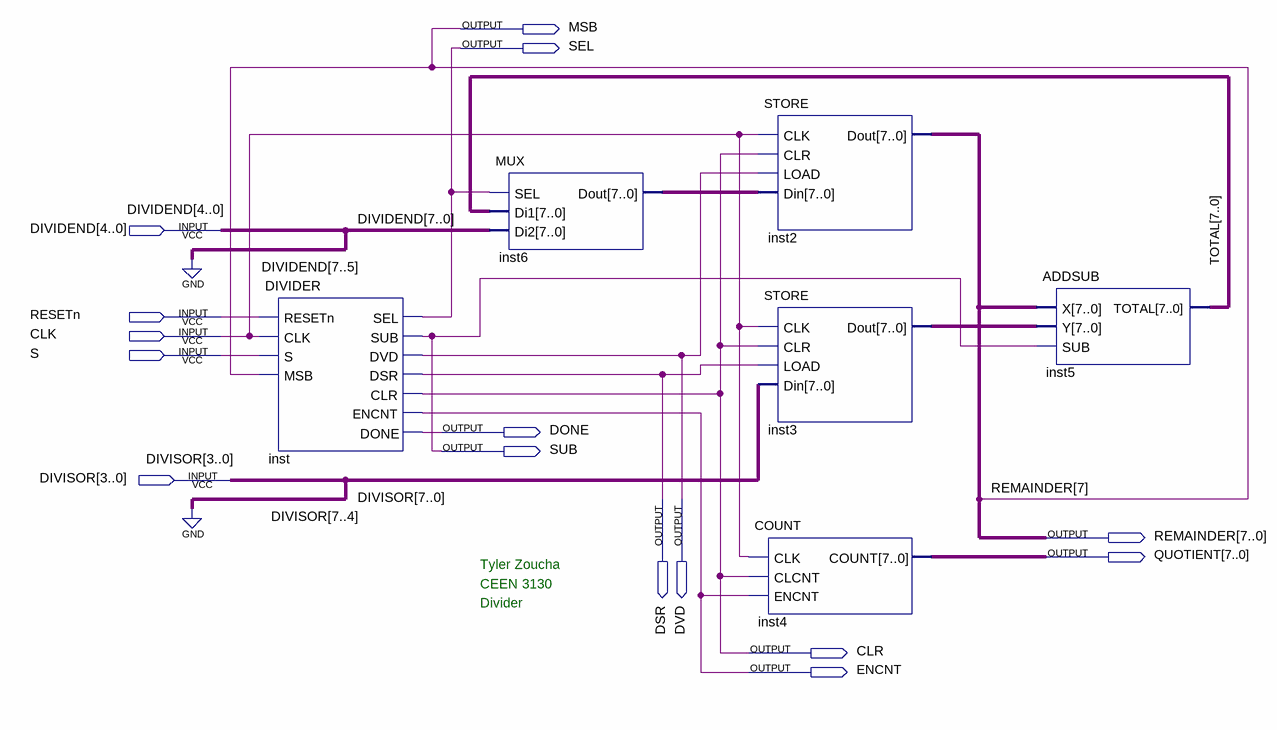
[diagram p0: schematic sheet]
// Quartus schematic Block1.bdf as structural Verilog: 6 symbols, 15 pins
module Block1 (
  input  [4:0] DIVIDEND,
  input  RESETn,
  input  CLK,
  input  S,
  input  [3:0] DIVISOR,
  output MSB,
  output SEL,
  output DONE,
  output SUB,
  output DSR,
  output DVD,
  output [7:0] REMAINDER,
  output [7:0] QUOTIENT,
  output CLR,
  output ENCNT
);

  wire [7:0] inst3_dout, inst6_dout, TOTAL;

  DIVIDER inst (
    .RESETn(RESETn), .CLK(CLK), .S(S), .MSB(MSB), .SEL(SEL), .SUB(SUB), .DVD(DVD), .DSR(DSR), .CLR(CLR),
    .ENCNT(ENCNT), .DONE(DONE));
  MUX inst6 (.SEL(SEL), .Di1(TOTAL), .Di2({3'b000, DIVIDEND}), .Dout(inst6_dout));
  STORE inst2 (.CLK(CLK), .CLR(CLR), .LOAD(DVD), .Din(inst6_dout), .Dout({MSB, REMAINDER[6:0]}));
  STORE inst3 (.CLK(CLK), .CLR(CLR), .LOAD(DSR), .Din({4'b0000, DIVISOR}), .Dout(inst3_dout));
  COUNT inst4 (.CLK(CLK), .CLCNT(CLR), .ENCNT(ENCNT), .COUNT(QUOTIENT));
  ADDSUB inst5 (.X({MSB, REMAINDER[6:0]}), .Y(inst3_dout), .SUB(SUB), .TOTAL(TOTAL));

  assign REMAINDER[7] = MSB;

  // Notes on the sheet:
  //   Tyler Zoucha
  //   CEEN 3130
  //   Divider
endmodule
